# EAGLE design MBUS reader surface mount (EAGLE 8.2.2)
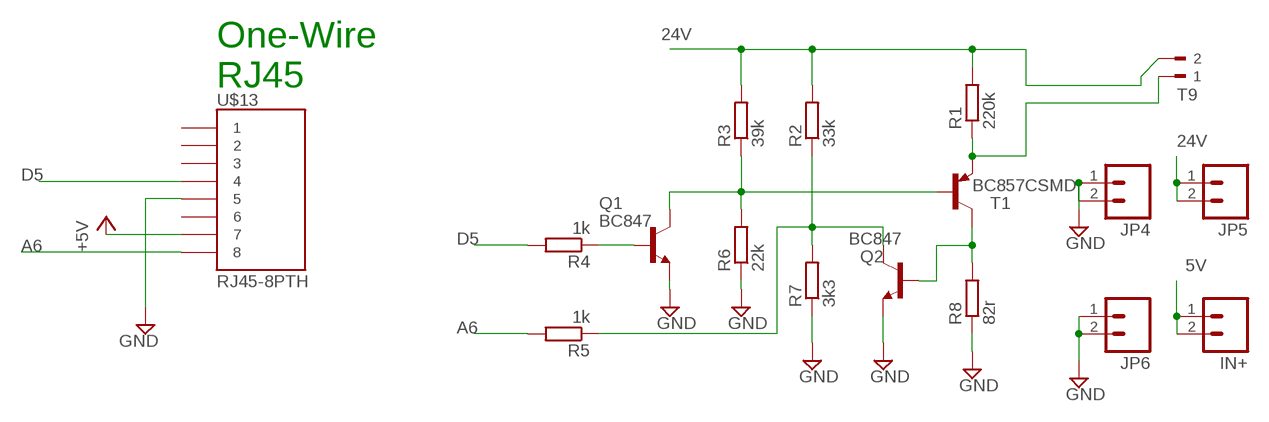
[diagram p0: schematic, sheet 1]

## Parts
IN+  M02PTH  [1X02]
JP4  M02PTH  [1X02]
JP5  M02PTH  [1X02]
JP6  M02PTH  [1X02]
Q1  BC847  [SOT23]
Q2  BC847  [SOT23]
R1  220k  R-EU_R0603  [R0603]
R2  33k  R-EU_R0603  [R0603]
R3  39k  R-EU_R0603  [R0603]
R4  1k  R-EU_R0603  [R0603]
R5  1k  R-EU_R0603  [R0603]
R6  22k  R-EU_R0603  [R0603]
R7  3k3  R-EU_R0603  [R0603]
R8  82r  R-EU_R0603  [R0603]
T1  BC857CSMD  [SOT23-BEC]
T9  180-2  [180-2]
U$13  RJ45-8PTH  [RJ45-8]

## Nets
5V [power]: IN+.1 IN+.2 U$13.7 ; supply symbol labelled +5V
24V: JP5.1 JP5.2 R1.2 R2.2 R3.2 T9.2
A6: R5.2 U$13.8
D5: R4.2 U$13.4
GND [power]: JP4.1 JP4.2 JP6.1 JP6.2 Q1.2(E) Q2.2(E) R6.1 R7.1 R8.1 U$13.5
N$13: R1.1 T1.E T9.1
N$16: Q2.1(B) R8.2 T1.C
N$18: Q1.3(C) R3.1 R6.2 T1.B
N$21: Q2.3(C) R2.1 R5.1 R7.2
N$25: Q1.1(B) R4.1
Unconnected: U$13.1 U$13.2 U$13.3 U$13.6

## Notes on the sheet
- One-Wire
  RJ45

## Library data of the parts
IN+ JP4-JP6 = SparkFun:M02: Header 2 Standard 2-pin 0.1" header. Use with straight break away headers (SKU : PRT-00116), right angle break away headers (PRT-00553), swiss pins (PRT-00743), machine pins (PRT-00117), and female headers (PRT-00115). Molex polarized connector foot print use with SKU : PRT-08233 with associated crimp pins and housings.
Q1 Q2 = transistor:BC847: NPN TRANSISTOR
R1-R8 = resistor:R-EU_: RESISTOR, European symbol
T1 = transistor-pnp:BC857*: PNP Transistror
T9 = con-weidmueller-sl35:180-2: WEIDMUELLER CLAMP CONNECTOR; OC_FARNELL: unknown; OC_NEWARK: unknown
U$13 = SparkFun-Connectors:RJ45-8: RJ45 Jack Simple RJ45, 8-pin connection - connector for common Cat5, Cat5e, and Cat6 Ethernet cables. Footprint not yet proven in production. Connector sku is PRT-00643; Breakout PCB sku is BOB-00716.

## Net classes
0 default: width 0.203 mm, drill 0.6 mm, clearance 0.203 mm
1 power: width 0.381 mm, drill 0.6 mm, clearance 0.254 mm
2 gnd: width 0.254 mm, drill 0.6 mm, clearance 0.254 mm

## Board
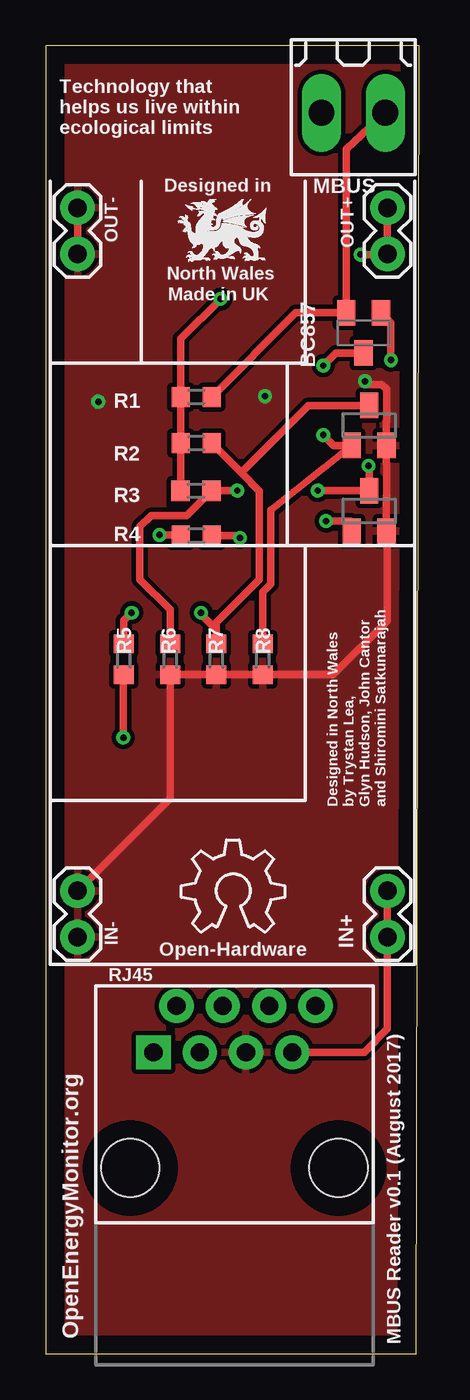
[diagram p1: board, top side]
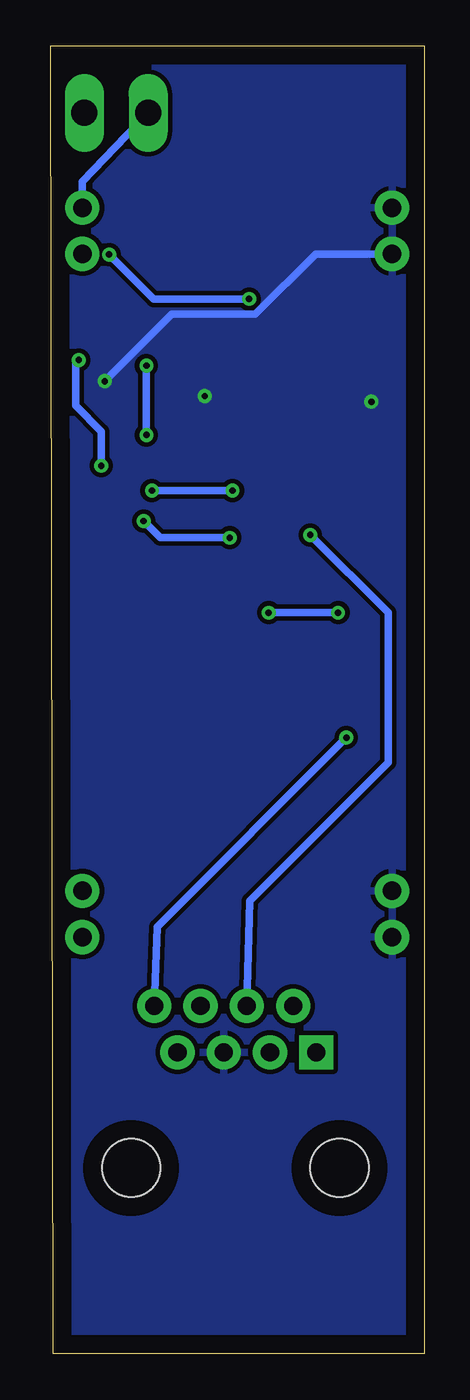
[diagram p2: board, bottom side, seen from below]

Size 20.5 x 71.82 mm. Coordinates in mm from the lower left corner, seen from the top.
Outline: 20.35,0 20.5,71.82 0,71.82 0,0 20.35,0
Copper layers (1*16): Top 0.035mm / dielectric 1.5mm / Bottom 0.035mm
Design rules "default *": minimum track width 10mil, minimum drill 24mil, track to track 8mil, track to pad 8mil, pad to pad 8mil, via to via 8mil, smd to smd 8mil, copper to edge 40mil, drill to drill 8mil, minimum pad ring 10mil, minimum via ring 8mil, stop-mask expansion 0.075mm, vias tented up to drill 0.6mm, thermal gap 10mil

### Footprints (pad centres in the part's own frame; a part is rotated, then mirrored left to right if it is on the bottom)
1X02 = drill 1.016 pad 1.88: 1 0,0; 2 2.54,0
SOT23 = smd 1 x 1.4: 1 -0.95,-1.1; 2 0.95,-1.1; 3 0,1.1
R0603 = smd 1 x 1.1: 1 -0.85,0; 2 0.85,0
SOT23-BEC = smd 1 x 1.4: B -0.95,-1.1; C 0,1.1; E 0.95,-1.1
180-2 = drill 1.422 long: 1 -1.75,0; 2 1.75,0
RJ45-8 = drill 1 pad 1.88 square: 1 -4.445,6.35 | drill 1 pad 1.88: 2 -3.175,8.89; 3 -1.905,6.35; 4 -0.635,8.89; 5 0.635,6.35; 6 1.905,8.89; 7 3.175,6.35; 8 4.445,8.89 | hole 3.2: -5.715,0; 5.715,0

### Placement (x,y rotation side)
IN+  18.76,22.88 90 top
JP4  1.76,60.38 90 top
JP5  18.76,60.38 90 top
JP6  1.76,22.88 90 top
LOGO1  OSHW_LOGO_6MILX0200-NT  [OSHW_6X200_NOTEXT]  7.45,23.15 0 top
Q1  17.76,46.27 0 top
Q2  17.76,50.97 0 top
R1  8.26,52.54 180 top
R2  8.26,50 180 top
R3  8.26,47.38 180 top
R4  8.26,44.91 180 top
R5  4.29,38.14 270 top
R6  6.83,38.14 90 top
R7  9.37,38.14 90 top
R8  11.91,38.14 90 top
T1  17.45,56.05 180 top
T9  16.89,68.13 180 top
U$13  10.36,10.21 0 top

### Tracks (layer width: path | path; a pad name or v marks a point on that pad's centre or on a via)
5V
  Top 0.406: IN+.2 IN+.1 18.75,22.87 18.75,17.83 17.48,16.56 U$13.7
24V  (via drill 0.35)
  Top 0.406: v9.6,57.91 7.41,55.72 R1.2 R2.2 R3.2 | v17.29,60.35 18.73,60.35 JP5.1 JP5.2
  Bottom 0.406: v9.6,57.91 14.85,57.91 v17.29,60.35 | JP5.2 18.76,64.36 T9.2
A6  (via drill 0.35)
  Top 0.406: v4.27,33.83 4.27,37.26 R5.2
  Bottom 0.406: U$13.8 14.66,23.44 v4.27,33.83
D5  (via drill 0.35)
  Top 0.406: v6.25,44.96 7.37,44.96 R4.2
  Bottom 0.406: U$13.4 9.58,24.87 1.98,32.46 1.98,40.69 v6.25,44.96
GND  (via drill 0.35)
  Top 0.406: 1.73,60.35 JP4.1 JP4.2 | JP6.2 6.83,30.5 R6.1 R7.1 R8.1 15.8,37.29 18.75,40.23 18.75,45.13 Q1.2 18.71,47.08 18.71,47.09 18.71,48.87 18.71,48.88 Q2.2 18.71,51.17 18.71,51.18 18.71,52.96 18.45,53.22 17.7,53.22 v17.53,53.4
  Bottom 0.406: v17.53,53.4 13.85,57.08 9.26,57.08 5.95,60.38 JP4.1
  other vias: 2.9,52.27 12.04,52.58
  pour Bottom (isolate 0.254): -0.15,65.38 -0.1,50.93 -0.1,19.84 -0.15,-1.07 20.57,-0.91 20.73,72.54 -0.15,72.54
  pour Top (isolate 0.254): -0.15,65.38 -0.23,47.09 -0.23,20.12 -0.15,15.24 0,-1.07 20.57,-0.91 20.73,72.54 -0.15,72.54
N$13
  Top 0.406: R1.1 13.73,57.15 T1.E 16.5,66.14 T9.1
N$16  (via drill 0.35)
  Top 0.406: R8.2 11.91,41.84 12.34,42.27 12.34,46.32 Q2.1 15.82,49.87 v15.24,50.44 | T1.C 15.94,54.95 v15.24,54.25
  Bottom 0.406: v15.24,54.25 v15.24,50.44
N$18  (via drill 0.35)
  Top 0.406: v10.52,47.4 10.5,47.38 R3.1 7.75,46.03 5.79,46.03 5.18,45.41 5.18,42.52 6.83,40.87 R6.2 | v14.94,47.4 17.73,47.4 Q1.3 17.76,48.72 v17.72,48.76 | v18.95,54.56 18.95,56.6 T1.B
  Bottom 0.406: v10.52,47.4 v14.94,47.4 | v17.72,48.76 17.72,50.64 19.13,52.05 19.13,54.38 v18.95,54.56
N$21  (via drill 0.35)
  Top 0.406: 9.37,40.16 R7.2 | 9.37,40.16 11.74,42.52 11.74,47.37 10.73,48.38 | 10.73,48.38 R2.1 | 9.37,40.16 9.17,39.95 8.53,40.58 v8.53,40.69 | Q2.3 14.42,52.07 10.73,48.38 | R5.1 4.29,40.26 v4.72,40.69
  Bottom 0.406: v4.72,40.69 v8.53,40.69
N$25  (via drill 0.35)
  Top 0.406: R4.1 10.56,44.91 v10.67,44.81 | v15.39,45.72 16.75,45.72 Q1.1
  Bottom 0.406: v10.67,44.81 14.48,44.81 v15.39,45.72

### Text on the board
tPlace: Technology that / helps us live within / ecological limits | Designed in | MBUS | OUT- | OUT+ | North Wales | Made in UK | BC857 | Designed in North Wales / by Trystan Lea, / Glyn Hudson, John Cantor / and Shiromini Satkunarajah | IN- | Open-Hardware | RJ45
_tsilk: OpenEnergyMonitor.org | MBUS Reader v0.1 (August 2017)